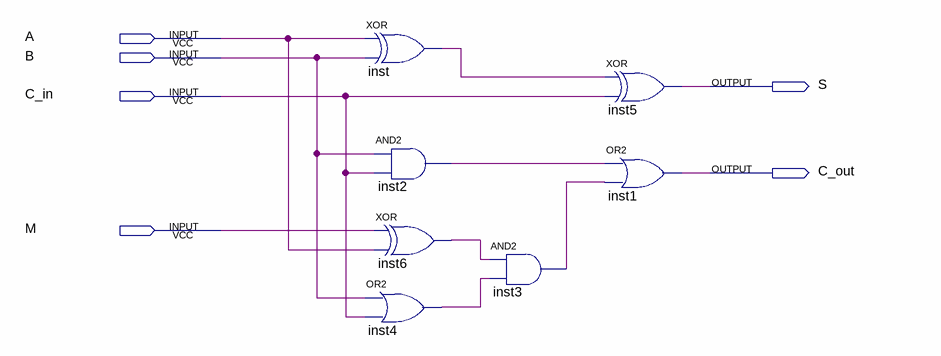
[diagram p0: schematic sheet]
// Quartus schematic somsubfull.bdf as structural Verilog: 7 symbols, 6 pins
module somsubfull (
  input  A,
  input  B,
  input  C_in,
  input  M,
  output S,
  output C_out
);

  wire inst2_out, inst3_out, inst4_out, inst6_out, inst_out;

  xor inst (inst_out, A, B);
  and inst2 (inst2_out, B, C_in);
  xor inst6 (inst6_out, M, A);
  or inst4 (inst4_out, B, C_in);
  and inst3 (inst3_out, inst6_out, inst4_out);
  xor inst5 (S, inst_out, C_in);
  or inst1 (C_out, inst2_out, inst3_out);
endmodule
